# EAGLE schematic Board (EAGLE 8.2.0)
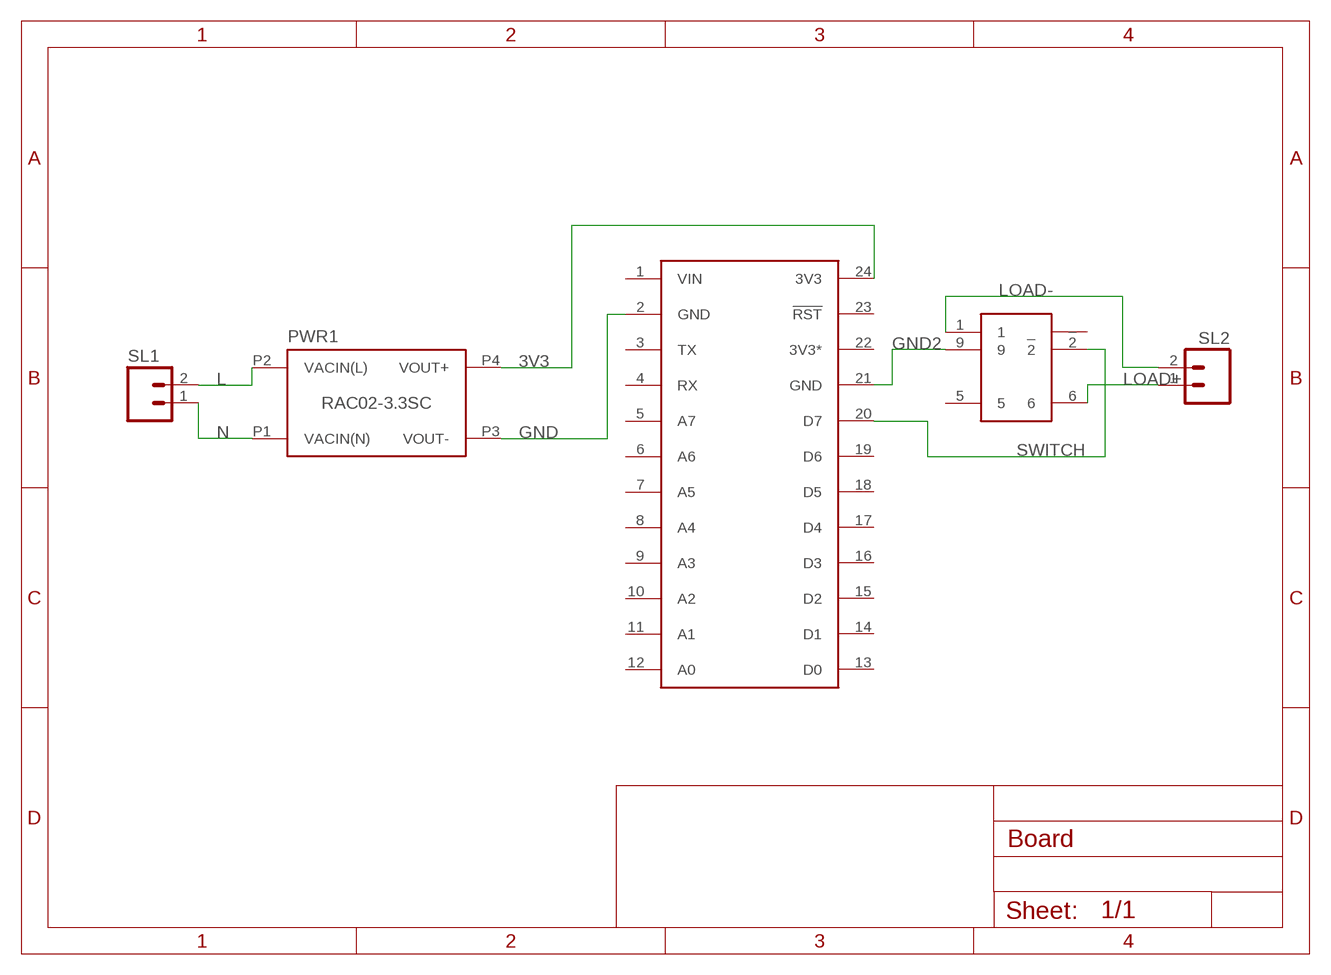
[diagram p0: schematic, sheet 1]

## Parts
CORE  SPARK_CORECORE  [SPARK_CORE]
PWR1  RAC02-3.3SC  [LOW_PROFILE_POWER_MODULE]
RELAY1  AZ9571AZ9571  [AZ9571]
SL1  M02  [02P]
SL2  M02  [02P]

## Nets
3V3: CORE.24(3V3) PWR1.P4(VOUT+)
GND: CORE.2(GND) PWR1.P3(VOUT-)
GND2: CORE.21(GND) RELAY1.9
L: PWR1.P2(VACIN(L)) SL1.2
LOAD+: RELAY1.6 SL2.1
LOAD-: RELAY1.1 SL2.2
N: PWR1.P1(VACIN(N)) SL1.1
SWITCH: CORE.20(D7) RELAY1.2
Unconnected: CORE.3(TX) CORE.4(RX) CORE.5(A7) CORE.6(A6) CORE.7(A5) CORE.8(A4) CORE.9(A3) CORE.10(A2) CORE.11(A1) CORE.12(A0) CORE.13(D0) CORE.14(D1) CORE.15(D2) CORE.16(D3) CORE.17(D4) CORE.18(D5) CORE.19(D6) CORE.23(!RST) RELAY1.5 RELAY1._

## Power pins joined to a net without a drawn wire
3V3*: CORE.22(3V3*)
VIN: CORE.1(VIN)

## Library data of the parts
CORE = Particle:SPARK_CORE
PWR1 = recom-powerline-acdc-converters:RAC*SC: RECOM POWERLINE AC/DC-Converter (RAC01-SC and RAC02-SC series) The RAC01-SC and RAC02-SC series are ultra-compact universal input AC/DC power modules for PCB mounting. They feature high efficiency, low standby power, high operating temperature, soft start and short-circuit protection as well as a built-in EMC Class B filter. Output voltages range from 3.3VDC to 24VDC. Datasheet <http://www.recom-power.com/pdf/Powerline-AC-DC/RAC01_02-SC.pdf>; INPUT_RANGE: 80 - 277 (VAC); MAX_CAPACITIVE_LOAD: 2000uF; OUTPUT_CURRENT: 600mA; OUTPUT_VOLTAGE: 3.3v
RELAY1 = Zettler:AZ9571
SL1 SL2 = con-amp-quick:M02: AMP QUICK CONNECTOR; OC_FARNELL: unknown; OC_NEWARK: unknown